# EAGLE design untitled (EAGLE 9.1.3)
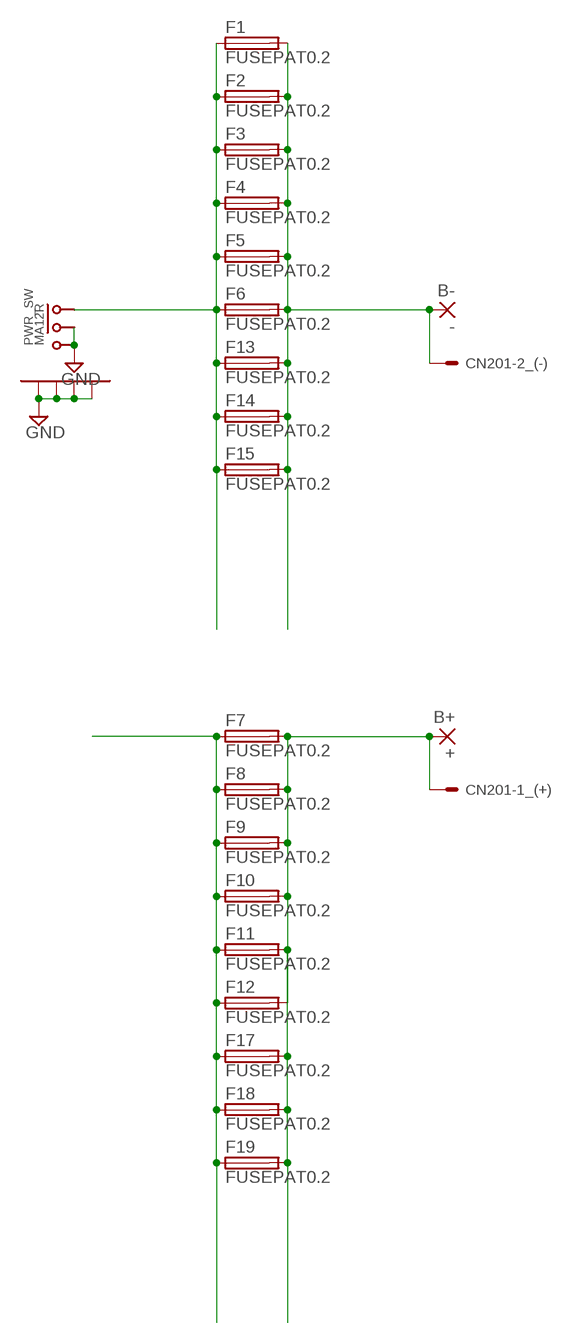
[diagram p0: schematic, sheet 1]

## Parts
B+  +  PAD2.5-5  [SMD2,5-5]
B-  -  PAD2.5-5  [SMD2,5-5]
CN201  2P_(POWER)53048  [53048-0210]
F1  FUSEPAT0.2  [FUSE_PAT1]
F2  FUSEPAT0.2  [FUSE_PAT1]
F3  FUSEPAT0.2  [FUSE_PAT1]
F4  FUSEPAT0.2  [FUSE_PAT1]
F5  FUSEPAT0.2  [FUSE_PAT1]
F6  FUSEPAT0.2  [FUSE_PAT1]
F7  FUSEPAT0.2  [FUSE_PAT1]
F8  FUSEPAT0.2  [FUSE_PAT1]
F9  FUSEPAT0.2  [FUSE_PAT1]
F10  FUSEPAT0.2  [FUSE_PAT1]
F11  FUSEPAT0.2  [FUSE_PAT1]
F12  FUSEPAT0.2  [FUSE_PAT1]
F13  FUSEPAT0.2  [FUSE_PAT1]
F14  FUSEPAT0.2  [FUSE_PAT1]
F15  FUSEPAT0.2  [FUSE_PAT1]
F17  FUSEPAT0.2  [FUSE_PAT1]
F18  FUSEPAT0.2  [FUSE_PAT1]
F19  FUSEPAT0.2  [FUSE_PAT1]
PWR_SW  MA12R  [MA12R]

## Nets
GND: PWR_SW.P$2 PWR_SW.P$3 PWR_SW.P$4 PWR_SW.P$5 PWR_SW.P$6 PWR_SW.P$7
N$1: F1.P$1 F2.P$1 F3.P$1 F4.P$1 F5.P$1 F6.P$1 F13.P$1 F14.P$1 F15.P$1 PWR_SW.P$1
N$2: B-.1(P) CN201.2 F1.P$2 F2.P$2 F3.P$2 F4.P$2 F5.P$2 F6.P$2 F13.P$2 F14.P$2 F15.P$2
N$3: F7.P$1 F8.P$1 F9.P$1 F10.P$1 F11.P$1 F12.P$1 F17.P$1 F18.P$1 F19.P$1
N$4: B+.1(P) CN201.1 F7.P$2 F8.P$2 F9.P$2 F10.P$2 F11.P$2 F12.P$2 F17.P$2 F18.P$2 F19.P$2

## Library data of the parts
B+ B- = 0 my parts:PAD
CN201 = 4 CONNECTOR:2P_(POWER)
F1-F15 F17-F19 = 3 FUSE:FUSE: Fuse
PWR_SW = 0 my parts:MA12R

## Board
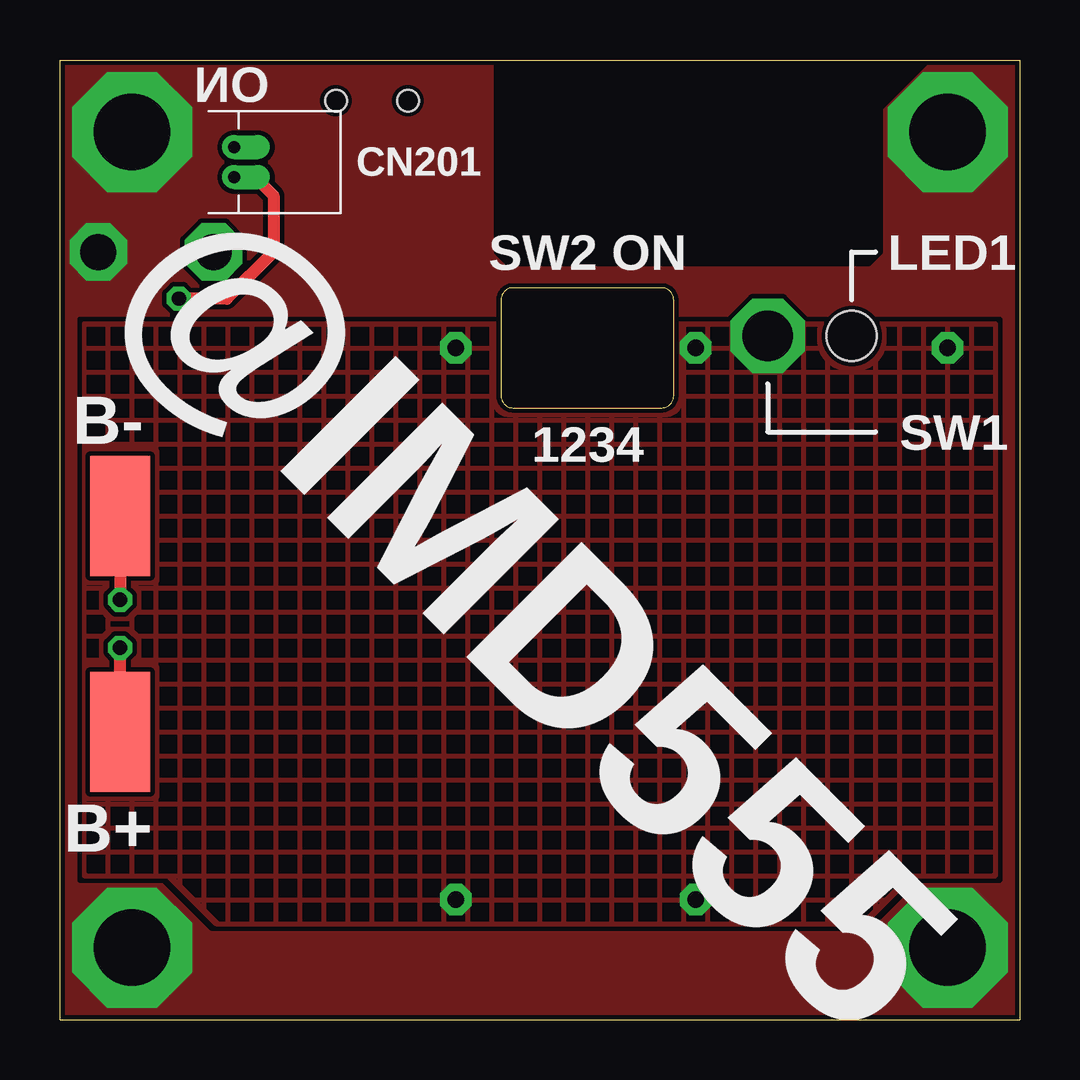
[diagram p1: board, top side]
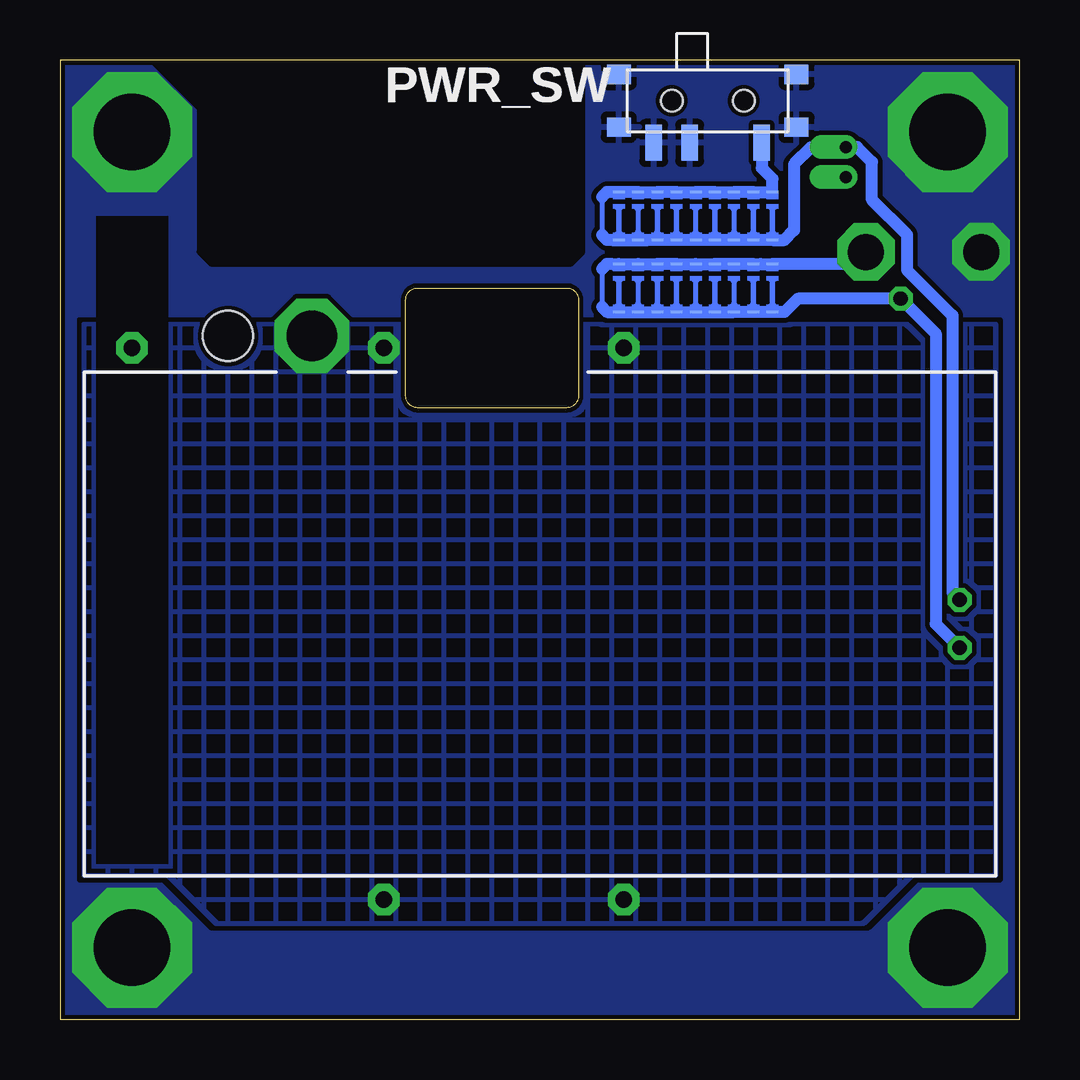
[diagram p2: board, bottom side, seen from below]

Size 40 x 40 mm. Coordinates in mm from the lower left corner, seen from the top.
Outline: 0,0 40,0 40,40 0,40 0,0
Outline: 18.39,30 18.39,26 arc90 18.89,25.5 25.09,25.5 arc90 25.59,26 25.59,30 arc90 25.09,30.5 18.89,30.5 arc90 18.39,30
Copper layers (1*16): Top 0.035mm / dielectric 1.5mm / Bottom 0.035mm
Design rules "SeeedStudio_2layer_DRU_no_angle_20140221_IMD555": minimum track width 0.2mm, minimum drill 0.3mm, track to track 0.2mm, track to pad 0.2mm, pad to pad 0.2mm, via to via 0.2mm, smd to smd 0mil, copper to edge 0.2mm, drill to drill 10mil, minimum pad ring 0.25mm, minimum via ring 0.2mm, stop-mask expansion 0.03mm, vias tented up to drill 5mm, thermal gap 10mil
Holes 2.1 mm at 33,28.5
tRestrict: area 18.2,31.5 to 36.2,40
bRestrict: area 35.5,6.5 to 38.5,33.5; area 18.2,31.5 to 36.2,40

### Footprints (pad centres in the part's own frame; a part is rotated, then mirrored left to right if it is on the bottom)
SMD2,5-5 = smd 2.5 x 5: 1 0,0
53048-0210 = drill 0.5 pad 1 offset: 1 0.625,0; 2 -0.625,0
FUSE_PAT1 = smd 0.1 x 0.5: P$1 -1,0; P$2 1,0
MA12R = smd 0.7 x 1.5: P$1 -2.25,1.75; P$2 0.75,1.75; P$3 2.25,1.75 | smd 1 x 0.8: P$4 -3.7,1.1; P$5 -3.7,-1.1; P$6 3.7,-1.1; P$7 3.7,1.1 | hole 0.9: -1.5,0; 1.5,0

### Placement (x,y rotation side)
B+  2.5,12 0 top
B-  2.5,21 0 top
CN201  7.25,35.75 270 top
F1  16.7,33.5 270 bottom
F2  15.9,33.5 270 bottom
F3  15.1,33.5 270 bottom
F4  14.3,33.5 270 bottom
F5  13.5,33.5 270 bottom
F6  12.7,33.5 270 bottom
F7  16.7,30.5 270 bottom
F8  15.9,30.5 270 bottom
F9  15.1,30.5 270 bottom
F10  14.3,30.5 270 bottom
F11  13.5,30.5 270 bottom
F12  12.7,30.5 270 bottom
F13  11.9,33.5 270 bottom
F14  11.1,33.5 270 bottom
F15  10.3,33.5 270 bottom
F17  11.9,30.5 270 bottom
F18  11.1,30.5 270 bottom
F19  10.3,30.5 270 bottom
PWR_SW  13,38.3 180 bottom

### Tracks (layer width: path | path; a pad name or v marks a point on that pad's centre or on a via)
GND  (via drill 1.5 pad 2.4, 3.2 pad 5)
  other vias: 3,37 37,37 37,3 3,3 1.6,32
  pour Bottom (rank 6): 0,40 40,40 40,0 0,0
  pour Top (rank 6): 0,40 40,40 40,0 0,0
N$1
  Bottom 0.2: 17.4,34.3 17.4,32.7
  Bottom 0.5: 16.5,34.5 F2.P$1 F3.P$1 F4.P$1 F5.P$1 F6.P$1 F13.P$1 F14.P$1 F15.P$1 10.3,35.05 10.6,35.35 10.75,35.5 PWR_SW.P$1 | 16.5,34.5 F1.P$1 | 17,34.5 17.2,34.5 | 17.2,34.5 17.4,34.3 | 16.5,34.5 17.2,34.5
N$2  (via drill 0.6 pad 1)
  Top 0.5: B-.1 v2.5,17.5
  Bottom 0.5: v2.5,17.5 2.8,17.8 2.8,29.35 4.7,31.25 4.7,32.71 6.15,34.17 6.15,35.75 6.78,36.38 CN201.2 8.59,36.38 8.61,36.35 8.7,36.35 9.4,35.65 9.4,32.9 9.8,32.5 F15.P$2 F14.P$2 F13.P$2 F6.P$2 F5.P$2 F4.P$2 F3.P$2 15.5,32.5 | F1.P$2 F2.P$2 15.5,32.5 | 17.4,32.7 17.2,32.5 17,32.5 15.5,32.5
N$3  (via drill 1.5 pad 2.4)
  Bottom 0.2: 17.4,31.3 17.4,29.7
  Bottom 0.5: F7.P$1 F8.P$1 | F8.P$1 F9.P$1 F10.P$1 F11.P$1 F12.P$1 F17.P$1 F18.P$1 10.8,31.5 F19.P$1 6.9,31.5 v6.4,32 | 17.4,31.3 17.35,31.35 17.2,31.5 17,31.5 F8.P$1
N$4  (via drill 0.6 pad 1)
  Top 0.5: B+.1 v2.5,15.5 | CN201.1 8.12,35.12 8.9,34.35 8.9,32.05 8.9,32 6.95,30.05 v4.95,30.05
  Bottom 0.5: v2.5,15.5 3.5,16.5 3.5,28.6 v4.95,30.05 9.25,30.05 9.8,29.5 10.05,29.5 F19.P$2 F18.P$2 F17.P$2 F12.P$2 F11.P$2 F10.P$2 F9.P$2 F8.P$2 | F7.P$2 F8.P$2 | 17.4,29.7 17.2,29.5 F8.P$2
N$5  (via drill 0.7 pad 1.3, 2.1 pad 3)
  other vias: 16.5,28 26.5,28 16.5,5 26.5,5 37,28 29.5,28.5
  pour Top (hatched): 1,6 4.5,6 6.5,4 33.5,4 35.5,6 39,6 39,29 1,29
  pour Bottom (hatched): 1,6 4.5,6 6.5,4 33.5,4 35.5,6 39,6 39,29 1,29

### Text on the board
tPlace: ON | SW2 ON | LED1 | 1234 | SW1 | @IMD555
_tNames: CN201 | B- | B+
_bNames: PWR_SW